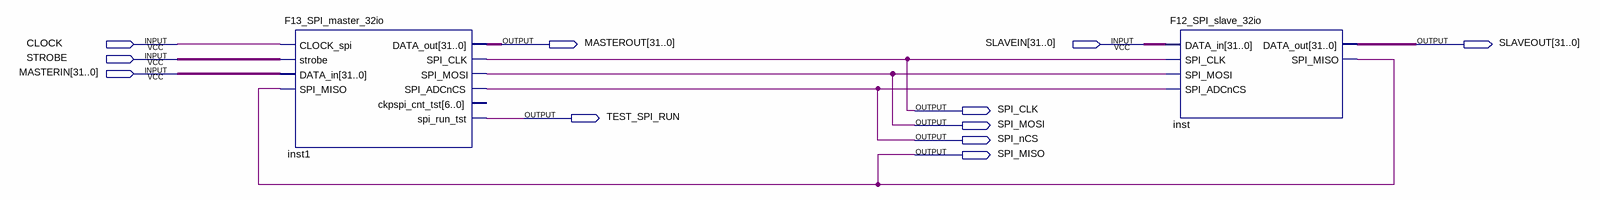
[diagram p0: schematic sheet]
// Quartus schematic TEST_SPIO.bdf as structural Verilog: 2 symbols, 11 pins
module TEST_SPIO (
  input  CLOCK,
  input  [31:0] SLAVEIN,
  input  STROBE,
  input  [31:0] MASTERIN,
  output [31:0] MASTEROUT,
  output [31:0] SLAVEOUT,
  output SPI_CLK,
  output TEST_SPI_RUN,
  output SPI_MOSI,
  output SPI_nCS,
  output SPI_MISO
);

  F13_SPI_master_32io inst1 (
    .CLOCK_spi(CLOCK), .strobe(STROBE), .DATA_in(MASTERIN), .SPI_MISO(SPI_MISO), .DATA_out(MASTEROUT),
    .SPI_CLK(SPI_CLK), .SPI_MOSI(SPI_MOSI), .SPI_ADCnCS(SPI_nCS), .spi_run_tst(TEST_SPI_RUN));  // open: ckpspi_cnt_tst
  F12_SPI_slave_32io inst (
    .DATA_in(SLAVEIN), .SPI_CLK(SPI_CLK), .SPI_MOSI(SPI_MOSI), .SPI_ADCnCS(SPI_nCS), .DATA_out(SLAVEOUT),
    .SPI_MISO(SPI_MISO));
endmodule
